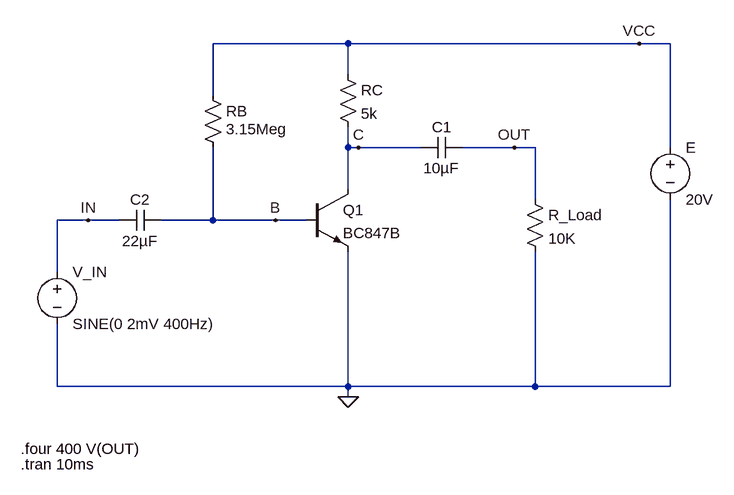
[diagram p0: schematic AEC.asc]
AEC.asc, the LTspice schematic file:
Version 4.1
SHEET 1 880 680
WIRE 208 -112 0 -112
WIRE 656 -112 208 -112
WIRE 704 -112 656 -112
WIRE 208 -64 208 -112
WIRE 0 -32 0 -112
WIRE 208 48 208 16
WIRE 224 48 208 48
WIRE 320 48 224 48
WIRE 464 48 384 48
WIRE 496 48 464 48
WIRE 704 48 704 -112
WIRE 208 112 208 48
WIRE 496 128 496 48
WIRE -192 160 -240 160
WIRE -144 160 -192 160
WIRE 0 160 0 48
WIRE 0 160 -80 160
WIRE 96 160 0 160
WIRE 144 160 96 160
WIRE -240 240 -240 160
WIRE -240 416 -240 320
WIRE 208 416 208 208
WIRE 208 416 -240 416
WIRE 496 416 496 208
WIRE 496 416 208 416
WIRE 704 416 704 128
WIRE 704 416 496 416
WIRE 208 432 208 416
FLAG 208 432 0
FLAG -192 160 IN
FLAG 464 48 OUT
FLAG 96 160 B
FLAG 656 -112 VCC
FLAG 224 48 C
SYMBOL npn 144 112 R0
SYMATTR InstName Q1
SYMATTR Value BC847B
SYMBOL cap 384 32 R90
WINDOW 0 0 32 VBottom 2
WINDOW 3 32 32 VTop 2
SYMATTR InstName C1
SYMATTR Value 10µF
SYMBOL res 480 112 R0
SYMATTR InstName R_Load
SYMATTR Value 10K
SYMBOL voltage -240 224 R0
WINDOW 123 0 0 Left 0
WINDOW 39 0 0 Left 0
SYMATTR InstName V_IN
SYMATTR Value SINE(0 2mV 400Hz)
SYMBOL cap -80 144 R90
WINDOW 0 0 32 VBottom 2
WINDOW 3 32 32 VTop 2
SYMATTR InstName C2
SYMATTR Value 22µF
SYMBOL res -16 -48 R0
WINDOW 3 36 68 Left 2
SYMATTR InstName RB
SYMATTR Value 3.15Meg
SYMBOL res 192 -80 R0
SYMATTR InstName RC
SYMATTR Value 5k
SYMBOL voltage 704 32 R0
SYMATTR InstName E
SYMATTR Value 20V
TEXT -296 512 Left 2 !.four 400 V(OUT)
TEXT -296 536 Left 2 !.tran 10ms

The netlist it stands for:
* AEC.asc
Q1 C B 0 0 BC847B
C1 OUT C 10µF
R_Load OUT 0 10K
V_IN IN 0 SINE(0 2mV 400Hz)
C2 B IN 22µF
RB VCC B 3.15Meg
RC VCC C 5k
V§E VCC 0 20V
.model NPN NPN
.model PNP PNP
.lib standard.bjt
.four 400 V(OUT)
.tran 10ms
.backanno
.end

* Results of the author's LTspice run, read from the files saved beside the schematic
* Operating Point, zero values left out:
*   V(b) = 654.3 mV
*   V(c) = 9.543 V
*   V(vcc) = 20 V
*   I(E) = -2.097 mA
*   I(RB) = 6.141 µA
*   I(RC) = 2.091 mA
*   Ib(Q1) = 6.141 µA
*   Ic(Q1) = 2.091 mA
*   Ie(Q1) = -2.097 mA
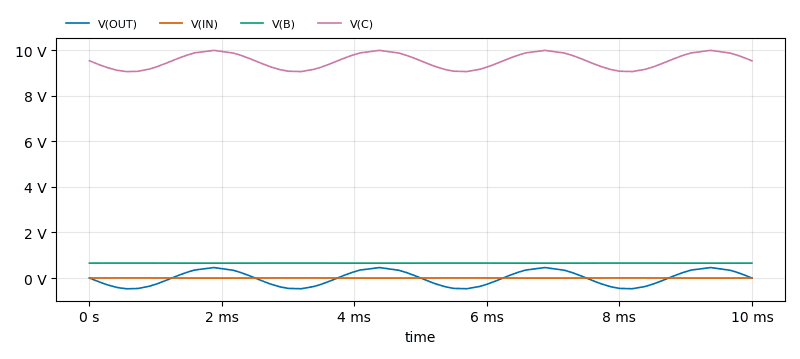
[diagram p1: Transient Analysis of AEC.asc, plotted from the saved traces]
* Transient Analysis, 1 run:
*   V(OUT): min -474.2 mV, max 459.7 mV, average -5.919 mV, rms 326.4 mV, last 854.6 µV
*   V(IN): min -1.997 mV, max 1.973 mV, average 12.95 µV, rms 1.388 mV, last 0 V
*   V(B): min 652.3 mV, max 656.3 mV, average 654.3 mV, rms 654.3 mV, last 654.3 mV
*   V(C): min 9.068 V, max 10 V, average 9.535 V, rms 9.541 V, last 9.544 V
* From the log:
*   Fourier components of V(OUT)
*   N-Period=1
*   DC component:-0.00279552
*   Harmonic  Frequency   Fourier   Normalized   Phase    Normalized
*    Number     [Hz]     Component   Component  [degree]  Phase [deg]
*       1      4.000e+02   4.700e-01   1.000e+00    -90.39°      0.00°
*       2      8.000e+02   6.749e-03   1.436e-02     -0.70°     89.69°
*       3      1.200e+03   2.097e-04   4.461e-04   -131.54°    -41.15°
*       4      1.600e+03   9.836e-05   2.093e-04    -94.75°     -4.36°
*       5      2.000e+03   2.585e-04   5.501e-04     54.26°    144.65°
*       6      2.400e+03   1.648e-04   3.507e-04     47.23°    137.62°
*       7      2.800e+03   2.432e-04   5.174e-04    -98.26°     -7.87°
*       8      3.200e+03   8.495e-05   1.807e-04    164.51°    254.90°
*       9      3.600e+03   1.354e-04   2.880e-04    137.00°    227.39°
*   Partial Harmonic Distortion: 1.439580%
*   Total Harmonic Distortion:   1.441223%